# Altium schematic sheet SHEET1-胡晓.SCHDOC
size A2
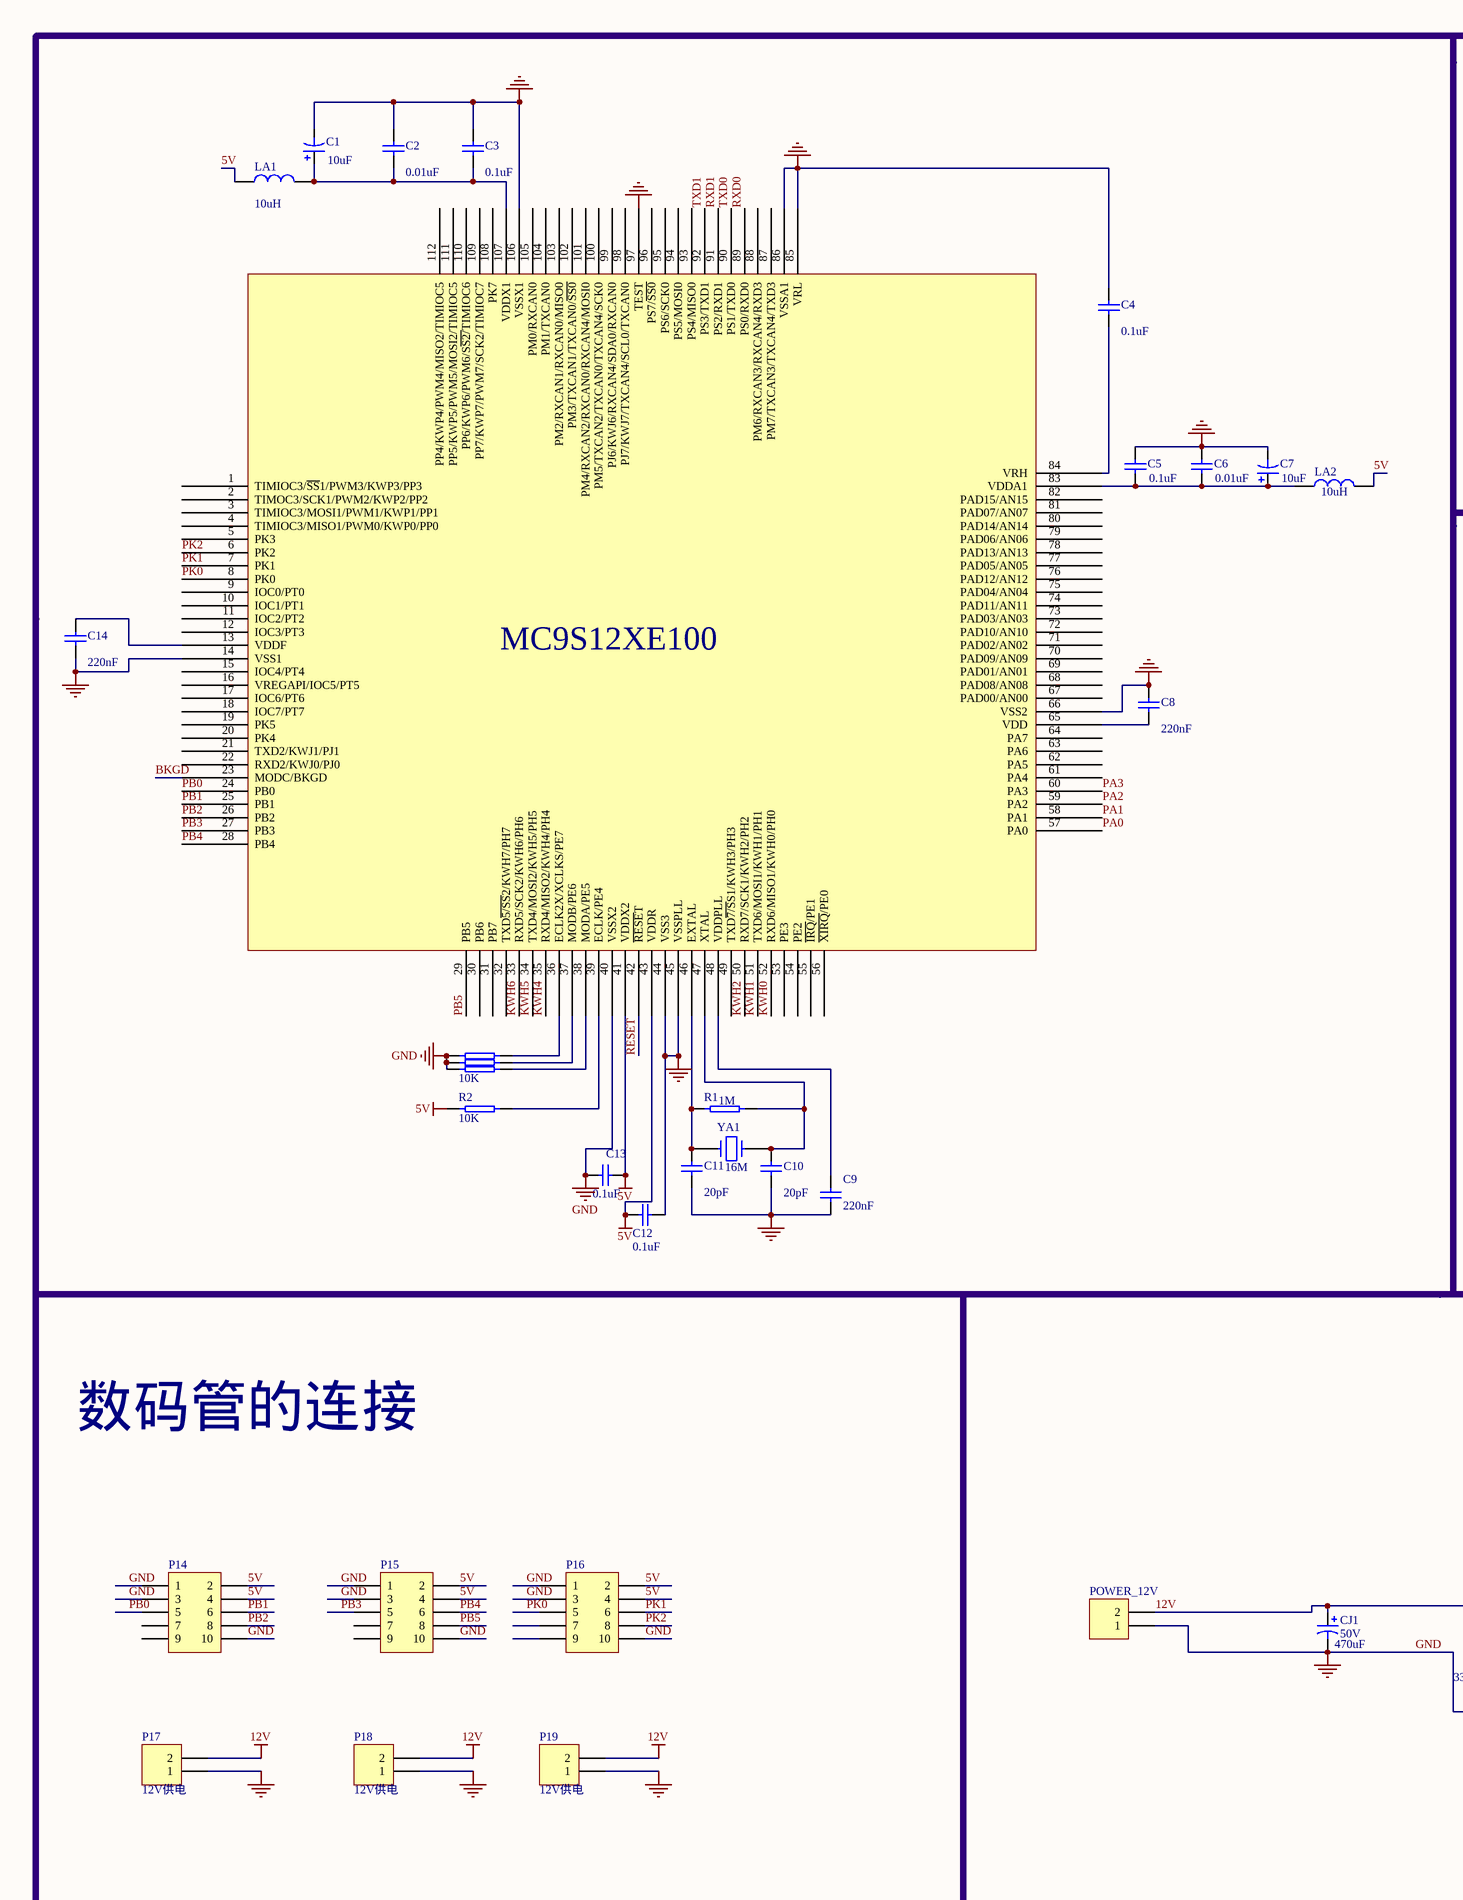
[diagram p0: SHEET1-胡晓.SCHDOC, left]
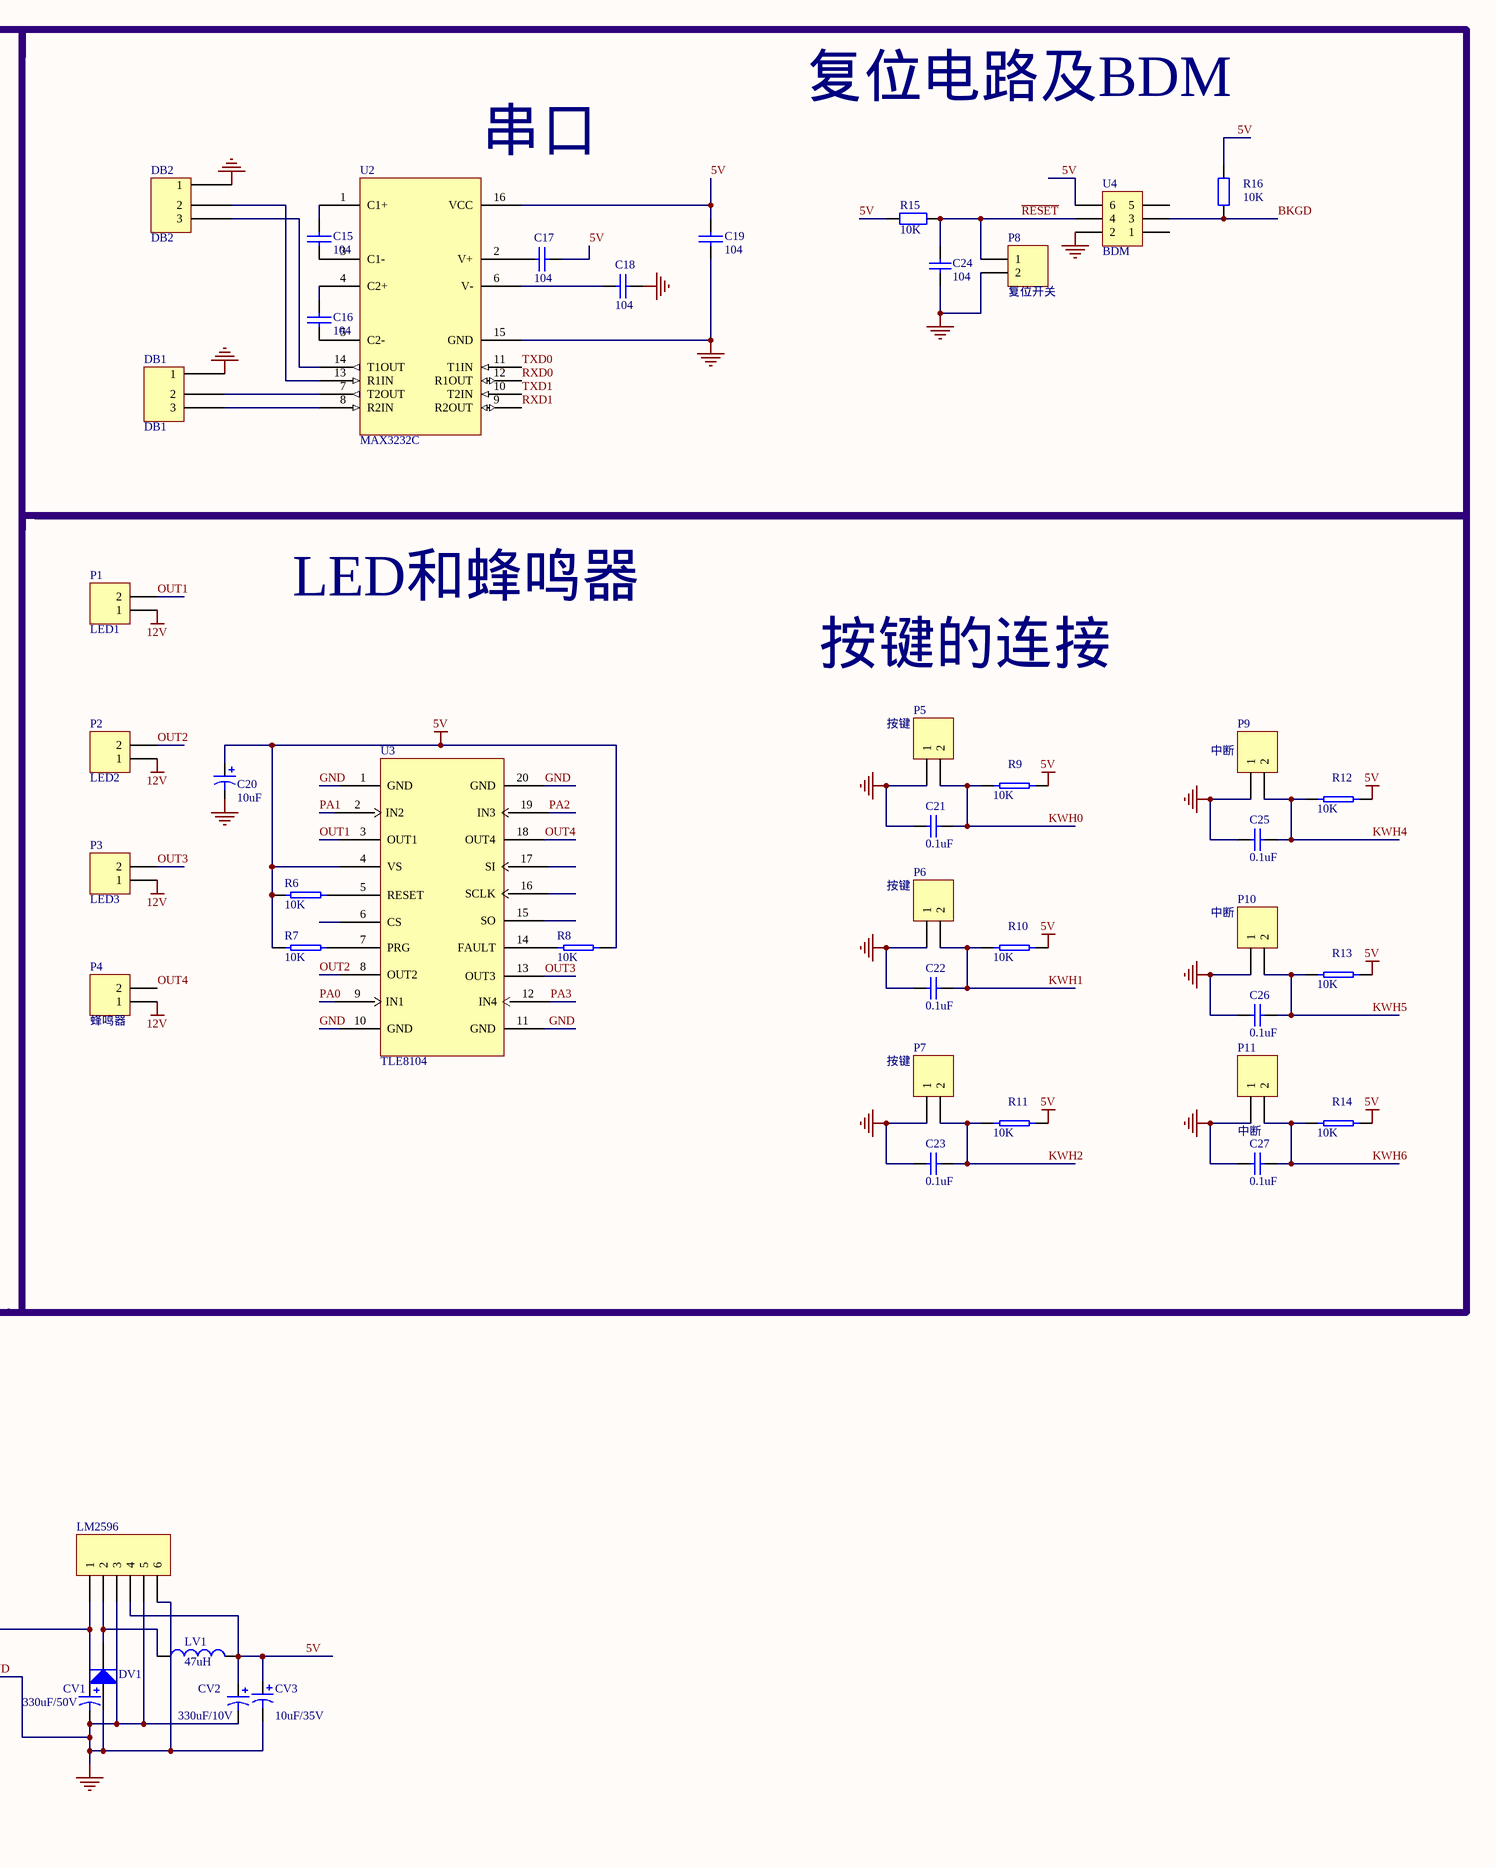
[diagram p1: SHEET1-胡晓.SCHDOC, right]

## Parts
C1  CA14  [LC0805-有方向的电容]  (value not drawn)
C2  CA13  [0805]  (value not drawn)
C3  CA12  [0805]  (value not drawn)
C4  CA11  [0805]  (value not drawn)
C5  CA8  [0805]  (value not drawn)
C6  CA9  [0805]  (value not drawn)
C7  CA10  [LC0805-有方向的电容]  (value not drawn)
C8  CA7  [0805]  (value not drawn)
C9  CA6  [0805]  (value not drawn)
C10  CA5  [0805]  (value not drawn)
C11  CA4  [0805]  (value not drawn)
C12  CA3  [0805]  (value not drawn)
C13  CA2  [0805]  (value not drawn)
C14  CA1  [0805]  (value not drawn)
C15  104  [0805]
C16  104  [0805]
C17  104  [0805]
C18  104  [0805]
C19  104  [0805]
C20  C20  [LC0805-有方向的电容]
C21  0.1uF  [0805]
C22  0.1uF  [0805]
C23  0.1uF  [0805]
C24  value 104  [0805]  (hidden comment: Cap)
C25  0.1uF  [0805]
C26  0.1uF  [0805]
C27  0.1uF  [0805]
CJ1  50V  value 470uF  [470uF]
CV1  value 330uF/50V  [50V/330uF]  (hidden comment: Cap Pol1)
CV2  value 330uF/10V  [10V/330uF]  (hidden comment: Cap Pol1)
CV3  value 10uF/35V  [35V/10uF]  (hidden comment: Cap Pol1)
DB1  DB1  [kf128-3P]
DB2  DB2  [kf128-3P]
DV1  Diode  [SMB-二极管]  (value not drawn)
LA1  LA2  [0805]  (value not drawn)
LA2  LA1  [0805]  (value not drawn)
LM2596  LM2596_5  [LM2596]  (value not drawn)
LV1  value 47uH  [47uH]  (hidden comment: Inductor)
MC1  UA1  [mc9s12xep100]  (value not drawn)
P1  LED1  [KF128-2p]
P2  LED2  [KF128-2p]
P3  LED3  [KF128-2p]
P4  蜂鸣器  [KF128-2p]
P5  按键  [KF128-2p]
P6  按键  [KF128-2p]
P7  按键  [KF128-2p]
P8  复位开关  [KF128-2p]
P9  中断  [KF128-2p]
P10  中断  [KF128-2p]
P11  中断  [KF128-2p]
P14  Header 5X2  [插针5x5]  (value not drawn)
P15  Header 5X2  [插针5x5]  (value not drawn)
P16  Header 5X2  [插针5x5]  (value not drawn)
P17  12V供电  [KF128-2p]
P18  12V供电  [KF128-2p]
P19  12V供电  [KF128-2p]
POWER_12V  Header 2  [KF128-2p]  (value not drawn)
R1  RA8  [0805]  (value not drawn)
R2  RA2  [0805]  (value not drawn)
R3  RA2  [0805]  (value not drawn)
R4  RA2  [0805]  (value not drawn)
R5  RA2  [0805]  (value not drawn)
R6  10K  [0805]
R7  10K  [0805]
R8  10K  [0805]
R9  10K  [0805]
R10  10K  [0805]
R11  10K  [0805]
R12  10K  [0805]
R13  10K  [0805]
R14  10K  [0805]
R15  value 10K  [0805]  (hidden comment: Res2)
R16  value 10K  [0805]  (hidden comment: Res2)
U2  MAX3232C  [MAX232]
U3  TLE8104  [TEL8104]
U4  BDM  [BDM]
YA1  YA1  [XTAL]  (value not drawn)

## Blocks framed on the sheet
MC9S12XE100: C1-C14 LA1 LA2 MC1 R1-R5 YA1
数码管的连接: P14-P19

## Nets
5V: C12.2 C13.1 C17.2 C19.1 C20.1 CV2.1 CV3.1 LA1.1 LA2.2 LM2596.4 LV1.2 MC1.41(VDDX2) MC1.43(VDDR) P14.2 P14.4 P15.2 P15.4 P16.2 P16.4 R2.2 R6.1 R7.1 R8.2 R9.2 R10.2 R11.2 R12.2 R13.2 R14.2 R15.1 R16.2 U2.16(VCC) U3.4(VS) U4.6
12V: CJ1.1 CV1.1 LM2596.1 P1.1 P2.1 P3.1 P4.1 P17.2 P18.2 P19.2 POWER_12V.2
GND: C1.2 C2.1 C3.2 C4.2 C5.2 C6.2 C7.2 C8.1 C9.1 C10.1 C11.1 C12.1 C13.2 C14.1 C18.2 C19.2 C20.2 C21.1 C22.1 C23.1 C24.1 C25.1 C26.1 C27.1 CJ1.2 CV1.2 CV2.2 CV3.2 DB1.1 DB2.1 DV1.1(A) LM2596.3 LM2596.5 LM2596.6 MC1.14(VSS1) MC1.40(VSSX2) MC1.44(VSS3) MC1.45(VSSPLL) MC1.66(VSS2) MC1.85(VRL) MC1.86(VSSA1) MC1.97(TEST) MC1.106(VSSX1) P5.1 P6.1 P7.1 P8.2 P9.1 P10.1 P11.1 P14.1 P14.3 P14.10 P15.1 P15.3 P15.10 P16.1 P16.3 P16.10 P17.1 P18.1 P19.1 POWER_12V.1 R3.2 R4.2 R5.2 U2.15(GND) U3.1(GND) U3.10(GND) U3.11(GND) U3.20(GND) U4.2
BKGD: MC1.23(MODC/BKGD) R16.1 U4.3
KWH0: C21.2 MC1.52(RXD6/MISO1/KWH0/PH0) P5.2 R9.1
KWH1: C22.2 MC1.51(TXD6/MOSI1/KWH1/PH1) P6.2 R10.1
KWH2: C23.2 MC1.50(RXD7/SCK1/KWH2/PH2) P7.2 R11.1
KWH4: C25.2 MC1.35(RXD4/MISO2/KWH4/PH4) P9.2 R12.1
KWH5: C26.2 MC1.34(TXD4/MOSI2/KWH5/PH5) P10.2 R13.1
KWH6: C27.2 MC1.33(RXD5/SCK2/KWH6/PH6) P11.2 R14.1
OUT1: P1.2 U3.3(OUT1)
OUT2: P2.2 U3.8(OUT2)
OUT3: P3.2 U3.13(OUT3)
OUT4: P4.2 U3.18(OUT4)
PA0: MC1.57(PA0) U3.9(IN1)
PA1: MC1.58(PA1) U3.2(IN2)
PA2: MC1.59(PA2) U3.19(IN3)
PA3: MC1.60(PA3) U3.12(IN4)
PB0: MC1.24(PB0) P14.5
PB1: MC1.25(PB1) P14.6
PB2: MC1.26(PB2) P14.8
PB3: MC1.27(PB3) P15.5
PB4: MC1.28(PB4) P15.6
PB5: MC1.29(PB5) P15.8
PK0: MC1.8(PK0) P16.5
PK1: MC1.7(PK1) P16.6
PK2: MC1.6(PK2) P16.8
~{RESET}: C24.2 P8.1 R15.2 U4.4
RESET: MC1.42(~{RESE}T)
RXD0: MC1.89(PS0/RXD0) U2.12(R1OUT)
RXD1: MC1.91(PS2/RXD1) U2.9(R2OUT)
TXD0: MC1.90(PS1/TXD0) U2.11(T1IN)
TXD1: MC1.92(PS3/TXD1) U2.10(T2IN)
NetC1_1: C1.1 C2.2 C3.1 LA1.2 MC1.107(VDDX1)
NetC4_1: C4.1 MC1.84(VRH)
NetC5_1: C5.1 C6.1 C7.1 LA2.1 MC1.83(VDDA1)
NetC8_2: C8.2 MC1.65(VDD)
NetC9_2: C9.2 MC1.48(VDDPLL)
NetC10_2: C10.2 MC1.47(XTAL) R1.2 YA1.2
NetC11_2: C11.2 MC1.46(EXTAL) R1.1 YA1.1
NetC14_2: C14.2 MC1.13(VDDF)
NetC15_1: C15.1 U2.1(C1+)
NetC15_2: C15.2 U2.3(C1-)
NetC16_1: C16.1 U2.4(C2+)
NetC16_2: C16.2 U2.5(C2-)
NetC17_1: C17.1 U2.2(V+)
NetC18_1: C18.1 U2.6(V-)
NetDB1_22: DB1.22(2) U2.7(T2OUT)
NetDB1_23: DB1.23(3) U2.8(R2IN)
NetDB2_22: DB2.22(2) U2.13(R1IN)
NetDB2_23: DB2.23(3) U2.14(T1OUT)
NetDV1_2: DV1.2(K) LM2596.2 LV1.1
NetMC1_36: MC1.36(ECLK2X/XCLKS/PE7) R5.1
NetMC1_37: MC1.37(MODB/PE6) R4.1
NetMC1_38: MC1.38(MODA/PE5) R3.1
NetMC1_39: MC1.39(ECLK/PE4) R2.1
NetR6_2: R6.2 U3.5(RESET)
NetR7_2: R7.2 U3.7(PRG)
NetR8_1: R8.1 U3.14(FAULT)

Not connected (* = marked no-connect by the designer): MC1 1(TIMIOC3/~{SS}1/PWM3/KWP3/PP3) 2(TIMOC3/SCK1/PWM2/KWP2/PP2) 3(TIMIOC3/MOSI1/PWM1/KWP1/PP1) 4(TIMIOC3/MISO1/PWM0/KWP0/PP0) 5(PK3) 9(IOC0/PT0) 10(IOC1/PT1) 11(IOC2/PT2) 12(IOC3/PT3) 15(IOC4/PT4) 16(VREGAPI/IOC5/PT5) 17(IOC6/PT6) 18(IOC7/PT7) 19(PK5) 20(PK4) 21(TXD2/KWJ1/PJ1) 22(RXD2/KWJ0/PJ0) 30(PB6) 31(PB7) 32(TXD~{5/SS}2/KWH7/PH7) 49(TXD~{7/S}S1/KWH3/PH3) 53(PE3) 54(PE2) 55(~{IRQ}/PE1) 56(~{XIRQ}/PE0) 61(PA4) 62(PA5) 63(PA6) 64(PA7) 67(PAD00/AN00) 68(PAD08/AN08) 69(PAD01/AN01) 70(PAD09/AN09) 71(PAD02/AN02) 72(PAD10/AN10) 73(PAD03/AN03) 74(PAD11/AN11) 75(PAD04/AN04) 76(PAD12/AN12) 77(PAD05/AN05) 78(PAD13/AN13) 79(PAD06/AN06) 80(PAD14/AN14) 81(PAD07/AN07) 82(PAD15/AN15) 87(PM7/TXCAN3/TXCAN4/TXD3) 88(PM6/RXCAN3/RXCAN4/RXD3) 93(PS4/MISO0) 94(PS5/MOSI0) 95(PS6/SCK0) 96(PS7/~{SS0}) 98(PJ7/KWJ7/TXCAN4/SCL0/TXCAN0) 99(PJ6/KWJ6/RXCAN4/SDA0/RXCAN0) 100(PM5/TXCAN2/TXCAN0/TXCAN4/SCK0) 101(PM4/RXCAN2/RXCAN0/RXCAN4/MOSI0) 102(PM3/TXCAN1/TXCAN0/~{SS0}) 103(PM2/RXCAN1/RXCAN0/MISO0) 104(PM1/TXCAN0) 105(PM0/RXCAN0) 108(PK7) 109(PP7/KWP7/PWM7/SCK2/TIMIOC7) 110(PP6/KWP6/PWM6/S~{S2/}TIMIOC6) 111(PP5/KWP5/PWM5/MOSI2/TIMIOC5) 112(PP4/KWP4/PWM4/MISO2/TIMIOC5); P14 7 9; P15 7 9; P16 7 9; U3 6(CS) 15(SO) 16(SCLK) 17(SI); U4 1 5

## Notes on the sheet
- 复位电路及BDM
- (near U2) 串口
- LED和蜂鸣器
- 按键的连接
- (in symbol CA1) 220nF
- (in symbol CA2) 0.1uF
- (in symbol CA3) 0.1uF
- (in symbol CA4) 20pF
- (in symbol CA5) 20pF
- (in symbol CA6) 220nF
- (in symbol CA7) 220nF
- (in symbol CA8) 0.1uF
- (in symbol CA9) 0.01uF
- (in symbol CA10) 10uF
- (in symbol CA11) 0.1uF
- (in symbol CA12) 0.1uF
- (in symbol CA13) 0.01uF
- (in symbol CA14) 10uF
- (in symbol LA1) 10uH
- (in symbol LA2) 10uH
- (in symbol RA2) 10K
- (in symbol RA8) 1M
- (in symbol YA1) 16M

## Library data of the parts
C15-C19 = CAP_1: Capacitor
C20 = CA10
C21-C23 C25-C27 = CA8
C24 = Cap: Capacitor; Published: 8-Jun-2000; LatestRevisionDate: 17-Jul-2002; LatestRevisionNote: Re-released for DXP Platform.; Publisher: Altium Limited
CJ1 CV1-CV3 = Cap Pol1: Polarized Capacitor (Radial); Published: 8-Jun-2000; LatestRevisionDate: 17-Jul-2002; LatestRevisionNote: Re-released for DXP Platform.; Publisher: Altium Limited
  CV1 CV2: PackageReference: RB7.6-15
DB1 DB2 = JA6
DV1 = Diode: Default Diode; Published: 8-Jun-2000; LatestRevisionDate: 17-Jul-2002; LatestRevisionNote: Re-released for DXP Platform.; PackageDocument: Sep-1996; PackageReference: SMC; Publisher: Altium Limited; Code_JEDEC: DO-214-AB
LM2596 = Header 6: Header, 6-Pin; LatestRevisionDate: 17-Jul-2002; LatestRevisionNote: Re-released for DXP Platform.; Publisher: Altium Limited
LV1 = Inductor: Code_IEC: 1005; Published: 8-Jun-2000; LatestRevisionDate: 17-Jul-2002; LatestRevisionNote: Re-released for DXP Platform.; PackageReference: 0402-A; Publisher: Altium Limited; Code_JEITA: 0402
P1-P11 P17-P19 POWER_12V = Header 2: Header, 2-Pin; LatestRevisionDate: 17-Jul-2002; LatestRevisionNote: Re-released for DXP Platform.; Publisher: Altium Limited
P14-P16 = Header 5X2: Header, 5-Pin, Dual row; LatestRevisionDate: 17-Jul-2002; LatestRevisionNote: Re-released for DXP Platform.; Publisher: Altium Limited
R6-R8 = RA2
R9-R14 = RA1
R15 R16 = Res2: Resistor; Published: 8-Jun-2000; LatestRevisionDate: 17-Jul-2002; LatestRevisionNote: Re-released for DXP Platform.; Publisher: Altium Limited
U2 = max232_1: Text Field1: 90; Text Field2: 190
U4 = JA1